# EasyEDA Pro project ProPrj_练手开发板_2024-08-21.epro, board T113_开发板
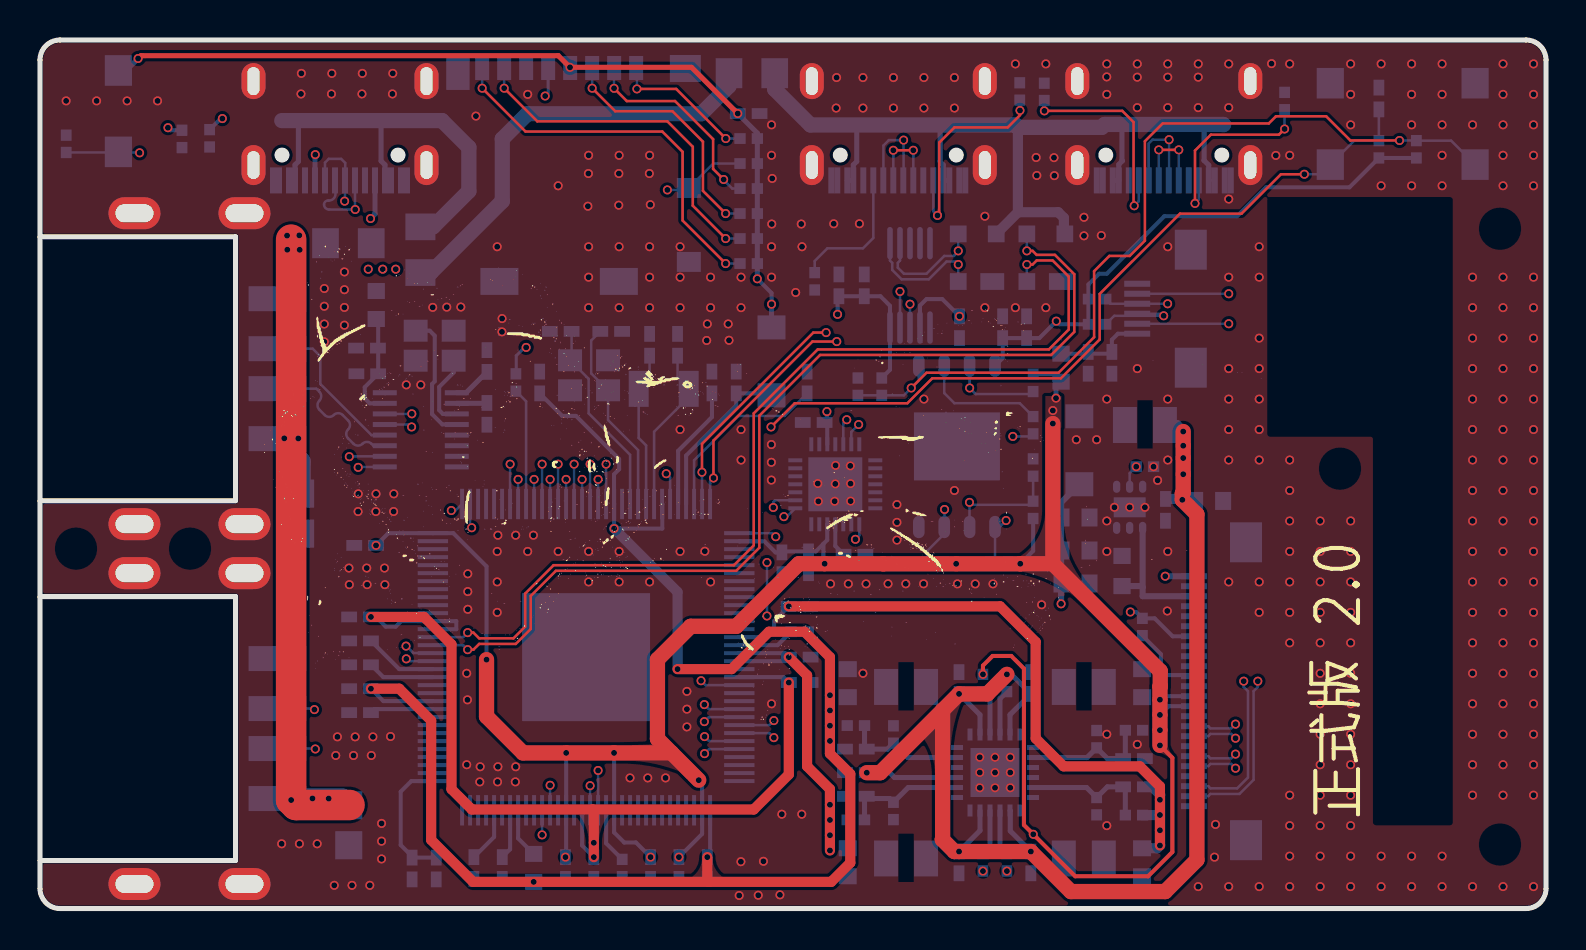
[diagram p5: board, top side]
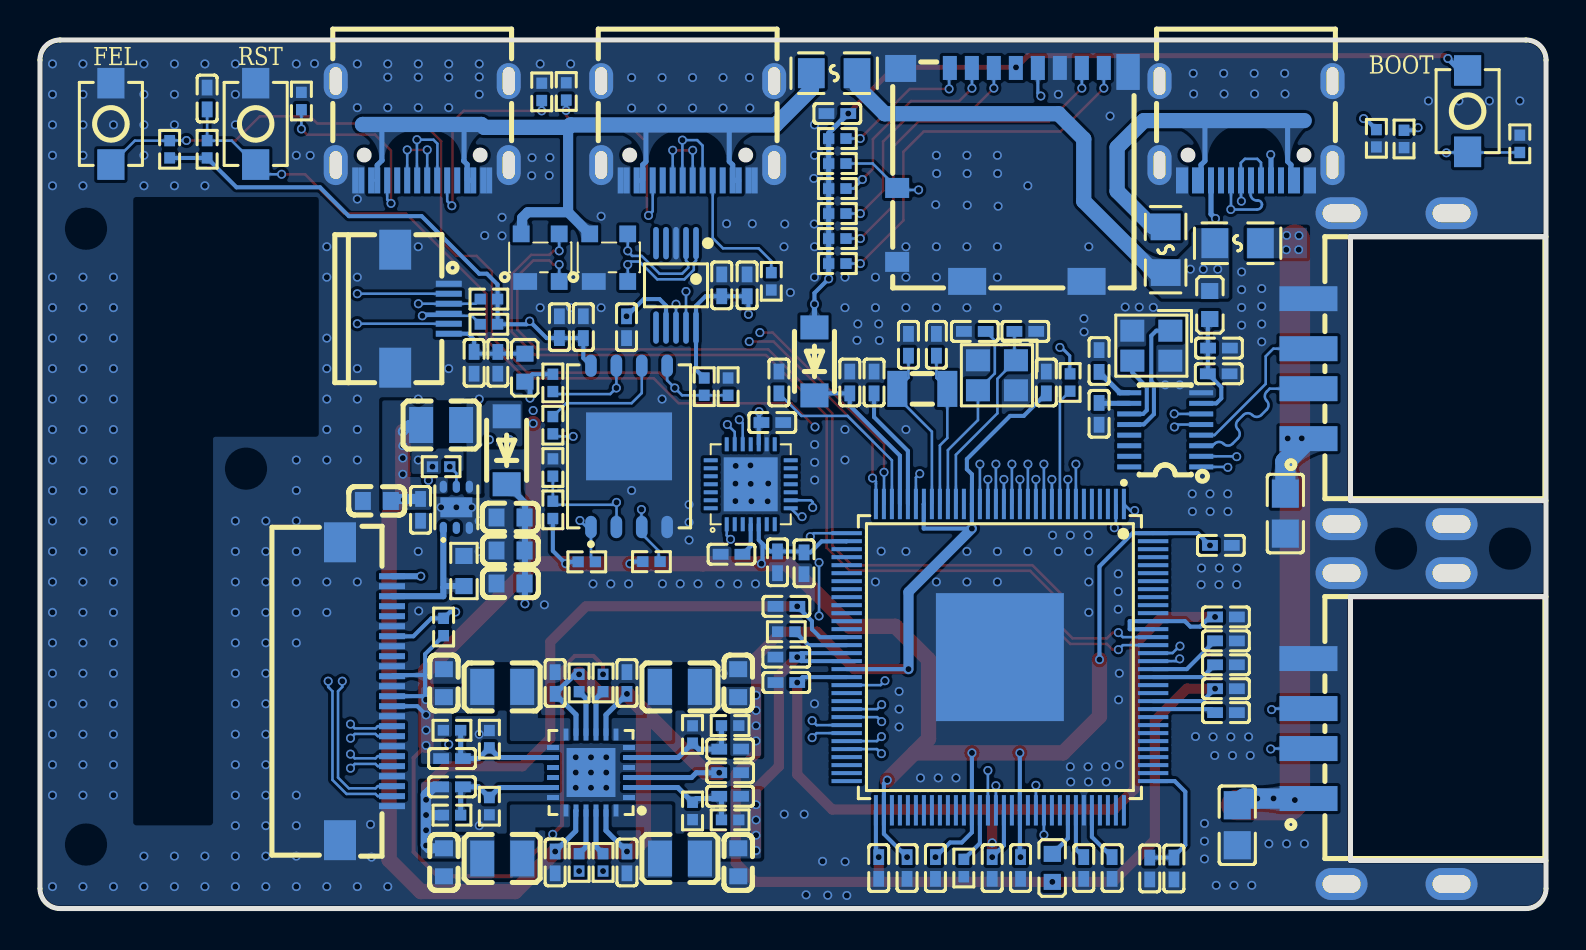
[diagram p6: board, bottom side, seen from below]

Outline 75.3 x 43.44 mm; copper layers: Top Layer, Inner1, Inner2, Bottom Layer. Coordinates in mm from the lower left corner of the outline.
Outline path: 0,42.44 0,1 arc(0.29,0.29) 1,0 74.3,0 arc(75.01,0.29) 75.3,1 75.3,42.44 arc(75.01,43.15) 74.3,43.44 1,43.44 arc(0.29,43.15) 0,42.44
Stack: Top Layer 0.035mm 外层铜厚1oz / Dielectric1 0.2104mm 7628 RC49% 8.6mil / Inner1 0.0152mm 内层铜厚 / Dielectric2 1.065mm 1.1mm H/HOZ 含铜 / Inner2 0.0152mm 内层铜厚 / Dielectric3 0.2104mm 7628 RC49% 8.6mil / Bottom Layer 0.035mm 外层铜厚1oz

## Design rules (mm)
net HUB_USB2_N: HUB_CH2
net HUB_USB2_P: HUB_CH2
net HUB_USB1_N: HUB_CH1
net HUB_USB1_P: HUB_CH1
net USB1_N: USB1
net USB1_P: USB1
net CH340_P: CH340
net CH340_N: CH340
net D0_N: MIPI_D0
net D0_P: MIPI_D0
net CLK_N: MIPI_CLK
net CLK_P: MIPI_CLK
net D1_N: MIPI_D1
net D1_P: MIPI_D1
net USB0_N: USB0
net USB0_P: USB0
net PC_N: DP1
net PC_P: DP1
template: 自定义配置
spacing copperThickness1oz (default): track to track 0.102, other pairs 0 to 0.3
track width copperThickness1oz (default): min 0.127, default 0.127, max 2.54
differential pair differentialPair (default): width min 0.127, default 0.127, max 2.54; gap min 0.152, default 0.152
via viaSize (default): diameter min 0.45, default 0.45, max 10; hole min 0.249, default 0.249, max 6.299
pour e18 uses power
pour e50 uses power
pour e150 uses power
pour e158 uses power
pour e335 uses power
pour e395 uses power
pour e423 uses power
pour e441 uses power
pour e468 uses power
pour e3233 uses power

## Placement (name value [footprint] x y rotation side)
C1  4.7uF  [C0402]  45.95 11.28 90 bottom
C2  22uF  [C0603]  55.11 11.27 270 bottom
C3  15pF  [C0402]  54.7 7.5 0 bottom
C4  4.7uF  [C0402]  49.54 2.31 270 bottom
C5  22uF  [C0603]  40.39 11.27 270 bottom
C6  15pF  [C0402]  40.79 7.97 180 bottom
C7  4.7uF  [C0402]  49.54 11.28 90 bottom
C8  4.7uF  [C0402]  40.79 6.79 180 bottom
C9  22uF  [C0603]  40.39 2.31 90 bottom
C10  15pF  [C0402]  40.79 5.61 180 bottom
C11  4.7uF  [C0402]  45.95 2.31 270 bottom
C12  22uF  [C0603]  55.1 2.31 90 bottom
C13  15pF  [C0402]  54.7 6.08 0 bottom
C14  1uF  [C0603]  51.77 16.26 180 bottom
C15  1uF  [C0603]  51.77 17.91 180 bottom
C16  1uF  [C0603]  51.77 19.56 180 bottom
C17  22uF  [C0603]  58.46 20.39 180 bottom
C18  100nF  [C0402]  56.27 19.94 270 bottom
C19  4.7uF  [C0402]  35.43 39.76 0 bottom
C20  100nF  [C0402]  49.33 29.08 90 bottom
C21  4.7uF  [C0402]  48.13 29.08 90 bottom
C31  4.7uF  [C0402]  16.36 26.75 180 bottom
C32  100nF  [C0402]  16.35 28.03 180 bottom
C33  4.7uF  [C0402]  22.35 27.38 90 bottom
C34  4.7uF  [C0402]  22.35 24.74 270 bottom
C37  4.7uF  [C0402]  41.21 31.17 270 bottom
C38  100nF  [C0402]  45.97 29.08 270 bottom
C39  4.7uF  [C0402]  39.94 31.17 270 bottom
C54  4.7uF  [C0402]  52.41 27.29 90 bottom
C55  100nF  [C0402]  53.59 27.29 90 bottom
C56  100nF  [C0402]  24.98 26.31 270 bottom
C57  4.7uF  [C0402]  16 13.39 0 bottom
C58  4.7uF  [C0402]  16 12.19 0 bottom
C59  4.7uF  [C0402]  33.6 26.31 90 bottom
C60  4.7uF  [C0402]  34.81 26.31 90 bottom
C61  NC  [C0402]  16 9.8 0 bottom
C62  15pF  [C0402]  26.03 28.86 180 bottom
C63  15pF  [C0402]  28.56 28.86 180 bottom
C64  4.7uF  [C0402]  18.61 2 90 bottom
C65  15pF  [C0402]  30.48 28.19 90 bottom
C66  100nF  [C0402]  38.35 26.31 270 bottom
C67  100nF  [C0402]  19.81 2 270 bottom
C68  100nF  [C0402]  37.1 17.27 90 bottom
C69  4.7uF  [C0402]  21.69 2.03 90 bottom
C70  15pF  [C0402]  31.88 28.19 90 bottom
C71  4.7uF  [C0402]  23.11 2.03 90 bottom
C72  100nF  [C0402]  37.98 15.11 180 bottom
C73  100nF  [C0402]  66.94 40.51 90 bottom
C74  100nF  [C0402]  30.53 2.03 270 bottom
C75  100nF  [C0402]  16.26 18.16 180 bottom
C76  100nF  [C0402]  26.27 2.03 270 bottom
C77  4.7uF  [C0402]  31.95 2.03 90 bottom
C78  100nF  [C0402]  37.99 11.3 0 bottom
C79  100nF  [C0402]  27.69 2.03 270 bottom
C80  4.7uF  [C0402]  16 14.58 0 bottom
C81  100nF  [C0402]  33.36 2.03 270 bottom
C82  4.7uF  [C0402]  16 10.99 0 bottom
C83  4.7uF  [C0402]  37.99 12.57 180 bottom
C84  100nF  [C0402]  40.72 17.72 180 bottom
C85  100nF  [C0402]  38.68 24.31 0 bottom
C86  100nF  [C0402]  38.43 17.32 90 bottom
C87  47uF  [C0805]  15.44 4.16 90 bottom
C88  47uF  [C0805]  13.03 19.75 90 bottom
D1  DSS210  [SOD-123_L2.8-W1.8-LS3.7-FD]  51.97 22.92 270 bottom
D2  PRTR5V0U2X  [SOT-143-4_L2.9-W1.3-P1.92-LS2.4-BL]  46.86 32.55 180 bottom
D3  PRTR5V0U2X  [SOT-143-4_L2.9-W1.3-P1.92-LS2.4-BL]  50.29 32.55 180 bottom
D4  DSS210  [SOD-123_L2.8-W1.8-LS3.7-FD]  36.58 27.36 270 bottom
F1  SL0805200  [F0805]  35.59 41.78 180 bottom
F2  SL0805200  [F0805]  19.02 32.95 270 bottom
F3  SL0805200  [F0805]  15.42 33.28 180 bottom
FPC1  AFC01-S24FCA-00  [FPC-SMD_P0.50-24P_FGS-XJ-H2.0]  59 10.87 90 bottom
FPC2  AFC01-S06FCA-00  [FPC-SMD_P0.50-6P_AFC01-S06FCA-00]  56.2 30 270 bottom
L1  1.5uH  [L0806]  52.19 11.08 180 bottom
L2  1.5uH  [L0806]  43.3 11.08 0 bottom
L3  1.5uH  [L0806]  43.3 2.5 0 bottom
L4  1.5uH  [L0806]  52.19 2.5 180 bottom
L6  GZ1608D601TF  [L0603]  16.81 30.18 270 bottom
L7  GZ1608D601TF  [L0603]  51.05 27.05 90 bottom
L8  GZ1608D601TF  [L0603]  24.68 2.03 90 bottom
R1  150kΩ  [R0402]  54.7 8.91 0 bottom
R2  33kΩ  [R0402]  52.83 8.47 270 bottom
R3  200kΩ  [R0402]  40.79 9.15 180 bottom
R4  100kΩ  [R0402]  42.67 8.7 90 bottom
R5  150kΩ  [R0402]  40.79 4.43 180 bottom
R6  100kΩ  [R0402]  48.34 11.28 270 bottom
R7  100kΩ  [R0402]  47.15 11.28 270 bottom
R8  100kΩ  [R0402]  47.15 2.31 90 bottom
R9  100kΩ  [R0402]  48.34 2.31 90 bottom
R10  100kΩ  [R0402]  42.67 4.88 270 bottom
R11  100kΩ  [R0402]  54.7 4.67 180 bottom
R12  200kΩ  [R0402]  52.83 5.12 270 bottom
R13  10kΩ  [R0402]  55.25 22.1 0 bottom
R14  10Ω  [R0603]  54.1 16.88 270 bottom
R15  10kΩ  [R0402]  35.43 38.51 0 bottom
R16  10kΩ  [R0402]  35.43 36.01 0 bottom
R17  10kΩ  [R0402]  35.43 34.76 0 bottom
R18  10kΩ  [R0402]  35.43 33.51 0 bottom
R19  10kΩ  [R0402]  35.43 32.26 0 bottom
R20  10kΩ  [R0402]  35.43 37.26 0 bottom
R21  10Ω  [R0402]  23.79 26.31 270 bottom
R22  10kΩ  [R0402]  47.96 17.34 0 bottom
R23  10kΩ  [R0402]  44.73 17.35 0 bottom
R24  10kΩ  [R0402]  49.66 26.29 90 bottom
R25  10kΩ  [R0402]  49.66 19.94 90 bottom
R26  NC  [R0402]  49.66 22.06 90 bottom
R27  10Ω  [R0402]  49.66 24.17 90 bottom
R28  NC  [R0402]  42.09 26.1 270 bottom
R29  10kΩ  [R0402]  40.89 26.1 90 bottom
R44  10kΩ  [R0402]  55.12 14.08 270 bottom
R45  10kΩ  [R0402]  52.86 29.22 180 bottom
R46  10kΩ  [R0402]  52.86 30.48 180 bottom
R47  240Ω  [R0402]  37.99 13.84 180 bottom
R48  240Ω  [R0402]  29.11 2.03 270 bottom
R49  10kΩ  [R0402]  66.94 37.97 270 bottom
R50  10kΩ  [R0402]  68.82 37.97 270 bottom
R55  5.1kΩ  [R0402]  62.23 40.39 270 bottom
R56  5.1kΩ  [R0402]  50.21 40.84 270 bottom
R57  5.1kΩ  [R0402]  48.99 40.87 270 bottom
R58  5.1kΩ  [R0402]  38.74 31.37 90 bottom
R59  5.1kΩ  [R0402]  7.1 38.49 90 bottom
R60  5.1kΩ  [R0402]  8.48 38.52 90 bottom
R61  10kΩ  [R0402]  1.31 38.25 270 bottom
SIM1  1040310811  [SIM-SMD_8P-1040310811]  26.67 36.7 0 bottom
SW1  TS342A2P-WZ  [SW-SMD_L4.0-W2.9-LS5.0]  64.52 39.24 90 bottom
SW2  TS342A2P-WZ  [SW-SMD_L4.0-W2.9-LS5.0]  71.75 39.24 90 bottom
SW3  TS342A2P-WZ  [SW-SMD_L4.0-W2.9-LS5.0]  3.92 39.88 90 bottom
U1  EA3059  [VQFN-24_L4.0-W4.0-P0.50-TL-EP2.5]  47.75 6.8 0 bottom
U2  10uH  [L0806]  55.25 24.18 180 bottom
U3  AW9962EDNR  [TDFN-6_L2.0-W2.0-P0.65-BL-EP]  54.48 20.07 180 bottom
U4  W25N01GVZEIG  [wson-8_l8.0-w6.10-p1.27-tl-ep]  45.85 23.11 90 bottom
U5  SL2.1s  [SSOP-16_L4.6-W2.6-P0.53-LS4.0-BL]  19.04 23.94 90 bottom
U6  CH340E  [MSOP-10_L3.0-W3.0-P0.50-LS5.0-BL]  43.5 31.17 0 bottom
U8  T113-S3  [tqfp-128_l14.0-w14.0-p0.40-ls16.0-bl-ep6.4]  27.31 12.57 0 bottom
U10  CH32V203G6U6  [QFN-28_L4.0-W4.0-P0.40-BL-EP2.7]  39.76 21.22 180 bottom
USB1  TYPEC-304A-ACP16W  [USB-C_SMD-TYPE-C-31-M-12]  42.92 38.9 0 bottom
USB2  TYPEC-304A-ACP16W  [USB-C_SMD-TYPE-C-31-M-12]  56.19 38.9 0 bottom
USB5  TYPEC-304A-ACP16W  [USB-C_SMD-TYPE-C-31-M-12]  15 38.9 0 bottom
USB6  U-A-24DS-W-1  [USB-A-SMD_U-A-24DS-W-1.]  8.3 9 90 bottom
USB7  U-A-24DS-W-1  [USB-A-SMD_U-A-24DS-W-1.]  8.3 27 90 bottom
X1  12MHz  [OSC-SMD_4P-L2.5-W2.0-BL]  19.73 28.15 0 bottom
X3  24MHz  [CRYSTAL-SMD_4P-L2.5-W2.0-BL]  27.45 26.67 0 bottom
X4  32.768kHz  [FC-135R_L3.2-W1.5]  31.18 25.99 0 bottom

## Footprints (pads in the part's own frame, mm; a bottom-side part is the same pattern mirrored in y, then rotated)
C0402
  rect 0.79x0.54 smd: 1(-0.545,0) 2(0.545,0)
C0603
  rect 0.8x0.9 smd: 1(-0.7,0) 2(0.7,0)
C0805
  rect 1.41x1.35 smd: 1(-1,0) 2(1,0)
CRYSTAL-SMD_4P-L2.5-W2.0-BL
  rect 1.2x1.1 smd: 1(-0.95,-0.75) 2(0.95,-0.75) 3(0.95,0.75) 4(-0.95,0.75)
F0805
  rect 1.335x1.5 smd: 1(-1.143,0) 2(1.143,0)
FC-135R_L3.2-W1.5
  rect 1x1.8 smd: 1(-1.25,0) 2(1.25,0)
FPC-SMD_P0.50-6P_AFC01-S06FCA-00
  rect 0.3x1.3 smd: 1(-1.248,1.339) 2(-0.748,1.339) 3(-0.248,1.339) 4(0.252,1.339) 5(0.752,1.339) 6(1.252,1.339)
  rect 2x1.6 smd: 7(-2.95,-1.339) 8(2.95,-1.339)
FPC-SMD_P0.50-24P_FGS-XJ-H2.0
  rect 0.3x1.3 smd: 1(-5.748,-1.3) 2(-5.248,-1.3) 3(-4.748,-1.3) 4(-4.248,-1.3) 5(-3.748,-1.3) 6(-3.248,-1.3) 7(-2.748,-1.3) 8(-2.248,-1.3) 9(-1.748,-1.3) 10(-1.248,-1.3) 11(-0.748,-1.3) 12(-0.248,-1.3) 13(0.252,-1.3) 14(0.752,-1.3) 15(1.252,-1.3) 16(1.752,-1.3) 17(2.252,-1.3) 18(2.752,-1.3) 19(3.252,-1.3) 20(3.752,-1.3) 21(4.252,-1.3) 22(4.752,-1.3) 23(5.252,-1.3) 24(5.752,-1.3)
  rect 2x1.6 smd: 25(7.45,1.3) 26(-7.45,1.3)
L0603
  rect 0.8x0.864 smd: 1(-0.7,0) 2(0.7,0)
L0806
  rect 1.2x1.8 smd: 1(-1,0) 2(1,0)
MSOP-10_L3.0-W3.0-P0.50-LS5.0-BL
  oval 0.28x1.62 smd: 1(-1,-2.11) 2(-0.5,-2.11) 3(0,-2.11) 4(0.5,-2.11) 5(1,-2.11) 6(1,2.11) 7(0.5,2.11) 8(0,2.11) 9(-0.5,2.11) 10(-1,2.11)
OSC-SMD_4P-L2.5-W2.0-BL
  rect 1.2x1.1 smd: 1(-0.95,-0.75) 2(0.95,-0.75) 3(0.95,0.75) 4(-0.95,0.75)
QFN-28_L4.0-W4.0-P0.40-BL-EP2.7
  rect 0.2x0.7 smd: 1(-1.2,-2) 2(-0.8,-2) 3(-0.4,-2) 4(-0.001,-2) 5(0.4,-2) 6(0.8,-2) 7(1.2,-2) 15(1.2,2) 16(0.8,2) 17(0.4,2) 18(0,2) 19(-0.4,2) 20(-0.8,2) 21(-1.2,2)
  rect 0.7x0.2 smd: 8(2,-1.2) 9(2,-0.8) 10(2,-0.4) 11(1.999,0) 12(2,0.4) 13(2,0.8) 14(2,1.2) 22(-2,1.2) 23(-2,0.8) 24(-2,0.4) 25(-2,0) 26(-2,-0.4) 27(-2,-0.8) 28(-2,-1.2)
  rect 2.7x2.7 smd: 29(0.001,0)
R0402
  rect 0.566x0.54 smd: 1(-0.433,0) 2(0.433,0)
R0603
  rect 0.806x0.864 smd: 1(-0.753,0) 2(0.753,0)
SIM-SMD_8P-1040310811
  rect 0.7x1.2 smd: 1(3.138,-5.338) 2(2.038,-5.338) 3(0.938,-5.338) 4(-0.163,-5.338) 5(-1.262,-5.338) 6(-2.362,-5.338) 7(-3.462,-5.338) 8(-4.562,-5.338)
  rect 1.17x1.8 smd: 9(-5.772,-5.138)
  rect 1.55x1.35 smd: 10(5.598,-5.312)
  rect 1.2x1 smd: 11(5.772,0.662) 12(5.772,4.362)
  rect 1.9x1.35 smd: 13(2.272,5.338) 14(-3.697,5.338)
SOD-123_L2.8-W1.8-LS3.7-FD
  rect 1.2x1.4 smd: 1(-1.7,0) 2(1.7,0)
SOT-143-4_L2.9-W1.3-P1.92-LS2.4-BL
  rect 1.194x0.838 smd: 1(-0.75,-1.192)
  rect 0.838x0.838 smd: 2(0.95,-1.192) 3(0.95,1.192) 4(-0.95,1.192)
SSOP-16_L4.6-W2.6-P0.53-LS4.0-BL
  rect 0.25x1.2 smd: 1(-1.855,-1.8) 2(-1.325,-1.8) 3(-0.795,-1.8) 4(-0.265,-1.8) 5(0.265,-1.8) 6(0.795,-1.8) 7(1.325,-1.8) 8(1.855,-1.8) 9(1.855,1.8) 10(1.325,1.8) 11(0.795,1.8) 12(0.265,1.8) 13(-0.265,1.8) 14(-0.795,1.8) 15(-1.325,1.8) 16(-1.855,1.8)
SW-SMD_L4.0-W2.9-LS5.0
  rect 1.53x1.36 smd: 1(-2.035,0) 2(2.035,0)
TDFN-6_L2.0-W2.0-P0.65-BL-EP
  oval 0.364x0.607 smd: 1(-0.65,-1.028) 2(0,-1.028) 3(0.65,-1.028) 4(0.65,1.028) 5(0,1.028) 6(-0.65,1.028)
  rect 1.6x1 smd: 7(0,0)
tqfp-128_l14.0-w14.0-p0.40-ls16.0-bl-ep6.4
  rect 0.2x1.52 smd: 1(-6.2,-7.66) 2(-5.8,-7.66) 3(-5.4,-7.66) 4(-5,-7.66) 5(-4.6,-7.66) 6(-4.2,-7.66) 7(-3.8,-7.66) 8(-3.4,-7.66) 9(-3,-7.66) 10(-2.6,-7.66) 11(-2.2,-7.66) 12(-1.8,-7.66) 13(-1.4,-7.66) 14(-1,-7.66) 15(-0.6,-7.66) 16(-0.2,-7.66) 17(0.2,-7.66) 18(0.6,-7.66) 19(1,-7.66) 20(1.4,-7.66) 21(1.8,-7.66) 22(2.2,-7.66) 23(2.6,-7.66) 24(3,-7.66) 25(3.4,-7.66) 26(3.8,-7.66) 27(4.2,-7.66) 28(4.6,-7.66) 29(5,-7.66) 30(5.4,-7.66) 31(5.8,-7.66) 32(6.2,-7.66) 65(6.2,7.66) 66(5.8,7.66) 67(5.4,7.66) 68(5,7.66) 69(4.6,7.66) 70(4.2,7.66) 71(3.8,7.66) 72(3.4,7.66) 73(3,7.66) 74(2.6,7.66) 75(2.2,7.66) 76(1.8,7.66) 77(1.4,7.66) 78(1,7.66) 79(0.6,7.66) 80(0.2,7.66) 81(-0.2,7.66) 82(-0.6,7.66) 83(-1,7.66) 84(-1.4,7.66) 85(-1.8,7.66) 86(-2.2,7.66) 87(-2.6,7.66) 88(-3,7.66) 89(-3.4,7.66) 90(-3.8,7.66) 91(-4.2,7.66) 92(-4.6,7.66) 93(-5,7.66) 94(-5.4,7.66) 95(-5.8,7.66) 96(-6.2,7.66)
  rect 1.52x0.2 smd: 33(7.66,-6.2) 34(7.66,-5.8) 35(7.66,-5.4) 36(7.66,-5) 37(7.66,-4.6) 38(7.66,-4.2) 39(7.66,-3.8) 40(7.66,-3.4) 41(7.66,-3) 42(7.66,-2.6) 43(7.66,-2.2) 44(7.66,-1.8) 45(7.66,-1.4) 46(7.66,-1) 47(7.66,-0.6) 48(7.66,-0.2) 49(7.66,0.2) 50(7.66,0.6) 51(7.66,1) 52(7.66,1.4) 53(7.66,1.8) 54(7.66,2.2) 55(7.66,2.6) 56(7.66,3) 57(7.66,3.4) 58(7.66,3.8) 59(7.66,4.2) 60(7.66,4.6) 61(7.66,5) 62(7.66,5.4) 63(7.66,5.8) 64(7.66,6.2) 97(-7.66,6.2) 98(-7.66,5.8) 99(-7.66,5.4) 100(-7.66,5) 101(-7.66,4.6) 102(-7.66,4.2) 103(-7.66,3.8) 104(-7.66,3.4) 105(-7.66,3) 106(-7.66,2.6) 107(-7.66,2.2) 108(-7.66,1.8) 109(-7.66,1.4) 110(-7.66,1) 111(-7.66,0.6) 112(-7.66,0.2) 113(-7.66,-0.2) 114(-7.66,-0.6) 115(-7.66,-1) 116(-7.66,-1.4) 117(-7.66,-1.8) 118(-7.66,-2.2) 119(-7.66,-2.6) 120(-7.66,-3) 121(-7.66,-3.4) 122(-7.66,-3.8) 123(-7.66,-4.2) 124(-7.66,-4.6) 125(-7.66,-5) 126(-7.66,-5.4) 127(-7.66,-5.8) 128(-7.66,-6.2)
  rect 6.4x6.4 smd: 129(0,0)
USB-A-SMD_U-A-24DS-W-1.
  rect 1.25x2.9 smd: 1(-3.5,3.577) 2(-1,3.577) 3(1,3.577) 4(3.5,3.577)
  oval 1.6x2.6 hole 0.9x1.9: 5(-7.775,-3.577) 5(-7.775,1.923) 5(7.775,-3.577) 5(7.775,1.923)
USB-C_SMD-TYPE-C-31-M-12
  oval 1.2x1.8 hole 0.6x1.4: 0(-4.325,-2.484) 0(4.325,-2.484)
  oval 1.2x2 hole 0.6x1.4: 0(-4.325,1.716) 0(4.325,1.716)
  rect 0.3x1.3 smd: A1(-3.35,2.484) A4(-2.55,2.484) A5(-1.25,2.484) A6(-0.25,2.484) A7(0.25,2.484) A8(1.25,2.484) A9(2.55,2.484) A12(3.35,2.484) B1(3.05,2.484) B4(2.25,2.484) B5(1.75,2.484) B6(0.75,2.484) B7(-0.75,2.484) B8(-1.75,2.484) B9(-2.25,2.484) B12(-3.05,2.484)
VQFN-24_L4.0-W4.0-P0.50-TL-EP2.5
  rect 0.6x0.25 smd: 1(-1.9,1.25) 2(-1.9,0.75) 3(-1.9,0.25) 4(-1.9,-0.25) 5(-1.9,-0.75) 6(-1.9,-1.25) 13(1.9,-1.25) 14(1.9,-0.75) 15(1.9,-0.25) 16(1.9,0.25) 17(1.9,0.75) 18(1.9,1.25)
  rect 0.25x0.6 smd: 7(-1.25,-1.9) 8(-0.75,-1.9) 9(-0.25,-1.9) 10(0.249,-1.9) 11(0.75,-1.9) 12(1.25,-1.9) 19(1.25,1.9) 20(0.75,1.9) 21(0.249,1.9) 22(-0.25,1.9) 23(-0.75,1.9) 24(-1.25,1.9)
  rect 2.45x2.45 smd: 25(0,0)
wson-8_l8.0-w6.10-p1.27-tl-ep
  oval 1.115x0.581 smd: 1(-4.033,1.905) 2(-4.033,0.635) 3(-4.033,-0.635) 4(-4.033,-1.905) 5(4.033,-1.905) 6(4.033,-0.635) 7(4.033,0.635) 8(4.033,1.905)
  rect 3.4x4.3 smd: 9(0,0)

## Nets
As in the schematic.

Pads without a net: FPC1 16 20 21; U1 15 16; U3 2; U5 13 14 15 16; U6 4 5 6; U8 3 4 5 6 21 35 36 37 38 39 40 41 42 43 44 45 53 54 61 62 63 64 67 68 69 70 71 72 73 74 75 76 82 84 87 88 93 94 95 96 98 99 100 101 102 103 104 105 108 109 118 119 120 121 122 123 124 125 126 127; U10 2 3 6 7 10 11 12 13 14 15 18 21 22 23 24 25 26 27 28; USB1 A8 B8; USB2 A8 B8; USB5 A8 B8

## Via types
v1: diameter 0.45, hole 0.3, Top Layer to Bottom Layer, 570 vias

## Routing (per net, layer and track width the routed paths; a pad name or vN(x,y) marks a point on that pad's centre or on a via; arc(x,y) is an arc through that point)
0.9V: length 116.3
  Top Layer w0.508: 27.63,4.95 35.69,4.95 37.44,6.71 v1(37.44,11.3) ; 27.63,4.95 21.59,4.95 20.57,5.97 20.57,13.21 19.2,14.58 v1(16.55,14.58) ; 27.63,4.95 27.69,4.89 v1(27.69,3.29) v1(27.69,2.57) ; v1(37.44,15.11) 48.01,15.11 49.78,13.33 49.78,8.51 51.18,7.11 54.99,7.11 56,6.11 v1(56,5.44) v1(56,4.68) v1(56,3.91) v1(56,3.15)
  Inner2 w0.762: v1(56,3.15) 56,2.34 54.67,1.02 39.37,1.02 36.81,3.58 27.89,3.58 27.69,3.38 v1(27.69,2.57)
  Bottom Layer w0.203: U8.46 36.31,13.57 36.7,13.97 36.7,14.38 v1(37.44,15.11) ; U8.116 19.65,13.97 20.81,13.97 20.81,14.37 U8.117 18.06,14.37 17.78,14.1 17.29,14.1 16.8,14.58 ; v1(27.69,2.57) 27.1,3.16 27.1,4.91 ; v1(37.44,11.3) 37.17,11.57 U8.51
  Bottom Layer w0.508: C12.2 55.86,3.01 v1(56,3.15) 56.01,3.17 56.01,5.69 55.62,6.08 C13.2 ; R11.1 55.99,4.67 v1(56,4.68)
1.5V: length 15.6
  Top Layer w0.508: v1(39.5,2.9) v1(39.5,3.67) v1(39.5,4.43) v1(39.5,5.19) 39.5,5.97 38.35,7.11 38.35,11.66 v1(37.44,12.57)
  Bottom Layer w0.203: U8.48 37.24,12.77 v1(37.44,12.57) 37.24,12.37 U8.49
1.8V: length 82.5
  Top Layer w0.508: 33.45,1.33 v1(24.68,1.33) 21.66,1.33 19.56,3.43 19.56,9.4 17.96,10.99 v1(16.55,10.99) ; 33.45,1.33 33.36,1.42 v1(33.36,2.57) ; 33.45,1.33 39.56,1.33 40.51,2.29 40.51,6.73 39.5,7.75 v1(39.5,8.38) v1(39.5,9.14) v1(39.5,9.91) v1(39.5,10.67) 39.5,12.57 38.23,13.84 36.45,13.84 34.58,11.97 v1(31.88,11.97)
  Bottom Layer w0.203: U8.107 17.17,10.37 v1(16.55,10.99) ; U8.50 v1(31.88,11.97) ; U8.65 33.5,2.71 v1(33.36,2.57) ; C56.2 26.11,24.64 26.8,24.64 28.96,22.48 28.96,21.97 28.7,21.72 28.7,20.24 U8.20 v1(28.71,19) 31.12,19 31.12,20.22 31.1,20.23
  Bottom Layer w0.508: v1(31.88,11.97) 31.88,15.83 v1(28.71,19)
3.3V: length 248.8
  Top Layer w0.203: v1(56,8.16) 56.62,7.54 56.62,2.83 55.41,1.61 51.76,1.61 v1(49.66,3.71) 49.2,4.18 49.2,12 48.56,12.63 47.63,12.63 47.15,12.15 v1(47.15,11.71)
  Top Layer w0.254: v1(34.89,39.76) 32.58,42.07 v1(26.5,42.07) 25.92,42.65 5.05,42.65 v1(4.91,42.52)
  Top Layer w0.762: 31.57,7.78 30.87,8.48 30.87,12.45 32.53,14.11 34.81,14.11 37.94,17.25 v1(39.23,17.25) 42.16,17.25 42.16,17.24 v1(45.81,17.24) 49.01,17.24 v1(49.01,17.25) 50.64,17.25 ; 31.57,7.78 v1(32.94,6.42) ; 31.57,7.78 v1(28.7,7.78) v1(26.31,7.78) 24.15,7.78 22.33,9.61 v1(22.33,12.45) ; v1(56,8.16) v1(56,8.92) v1(56,9.68) v1(56,10.44) 56,11.1 56.01,11.11 56.01,11.88 50.64,17.25 ; 50.64,17.25 v1(50.64,24.26)
  Inner1 w0.762: v1(50.82,29.38) 50.8,29.36 50.8,27.45 ; v1(50.64,24.26) v1(50.64,24.91) 50.64,25.37 v1(50.8,25.53) 50.8,27.45 ; v1(36.58,30.23) 37.08,29.72 v1(39.88,29.72) 39.88,29.71 40.24,29.35 40.64,29.35 ; 40.64,29.35 45.7,29.35 v1(45.97,29.62) 45.97,28.13 46.66,27.45 50.8,27.45 ; 40.64,29.35 40.64,27.89 39.34,26.59 v1(39.34,24.85) 39.34,24.36
  Inner2 w0.203: v1(49.66,3.71) 48.34,2.39 v1(48.34,1.87) v1(47.15,1.87)
  Bottom Layer w0.203: v1(45.97,29.62) 45.11,30.48 44.32,30.48 44,30.16 U6.7 ; v1(31.95,2.57) 33.1,3.73 33.1,6.25 v1(32.94,6.42) ; v1(26.27,2.57) 26.31,2.6 U8.83 26.31,4.92 v1(26.31,7.78) ; FPC1.11 56.43,10.12 v1(56,9.68) ; FPC1.12 56.17,10.62 56.04,10.49 ; U8.34 34.98,18.36 36.22,18.36 36.78,17.81 C68.2 37.15,17.86 C86.2 38.79,17.86 39.17,18.24 ; 39.26,24.32 39.34,24.4 v1(39.34,24.85) ; R24.2 50.68,26.72 L7.1 ; R50.2 R49.2 65.47,36.07 61.3,36.07 59.86,34.63 56.22,34.63 53.34,31.75 52.96,31.75 52.42,31.21 R46.2 R45.2 50.97,29.22 v1(50.82,29.38) 49.97,28.53 C20.1 C21.1 48.13,27.53 U4.8 ; 39.17,18.24 39.17,17.3 v1(39.23,17.25) ; 39.17,18.24 39.36,18.43 39.36,19.22 ; C85.2 39.36,24.17 U10.17 ; v1(22.33,12.45) 22.33,17.11 20.67,18.77 U8.128 17.41,18.77 v1(16.8,18.16) ; R25.1 49.66,17.89 v1(49.01,17.25) 48.92,17.34 R22.2 ; 56.04,10.49 56.04,11.67 ; 56.04,10.49 v1(56,10.44) ; R28.1 42.5,26.95 U6.10 42.5,30.14 42.02,30.62 C37.2 C39.2 39.88,30.56 v1(39.88,29.72) ; 56.04,11.67 57.65,11.67 FPC1.14 ; 56.04,11.67 56.04,12.72 55.12,13.65 ; v1(30.53,2.57) 29.8,3.3 29.21,3.3 28.71,3.81 U8.77 28.71,7.78 v1(28.7,7.78) ; v1(35.87,31.5) 36.58,30.78 v1(36.58,30.23) ; v1(45.81,17.24) 45.7,17.35 R23.2
  Bottom Layer w0.254: v1(4.91,42.52) 4.31,41.92 SW3.2 ; L7.1 50.8,26.1 v1(50.8,25.53) ; v1(34.89,39.76) 35.87,38.78 R15.2 R20.2 R16.2 R17.2 R18.2 R19.2 v1(35.87,31.5) ; D4.1 v1(36.58,30.23)
5V: length 146.8
  Top Layer w0.762: 45.13,9.91 v1(45.95,10.73) 47.37,10.73 v1(48.34,11.71) ; 45.13,9.91 45.13,3.47 45.12,3.45 45.72,2.85 v1(45.95,2.85) v1(49.54,2.85) 51.54,0.85 56.26,0.85 57.84,2.43 57.84,19.71 v1(57.12,20.44) 57.12,20.76 57.16,20.8 v1(57.16,21.72) v1(57.16,22.53) v1(57.16,23.15) v1(57.16,23.86) ; 45.13,9.91 42.01,6.79 v1(41.34,6.79)
  Inner1 w0.762: v1(16.41,31.98) v1(17.14,31.98) v1(17.79,31.98) 19.18,31.98 21.28,34.08 31.04,34.08 32.45,35.49 52.69,35.49 57.12,31.06 v1(57.12,20.44)
  Bottom Layer w0.254: U1.23 47,3.9 v1(45.95,2.85) ; U1.8 47,9.69 v1(45.95,10.73) ; v1(49.54,2.85) 48.51,3.88 48.51,4.89 U1.20 ; v1(48.34,11.71) 48.56,11.71 C7.1 48.5,9.69 U1.11 ; U1.3 42.72,6.55 42.48,6.79 v1(41.34,6.79)
  Bottom Layer w0.508: C18.1 57.66,20.48 C17.2 ; v1(57.16,23.86) 56.84,24.18 U2.1
  Bottom Layer w0.762: F2.2 19.54,31.81 23.11,35.38 23.11,38.49 24.37,39.75 33.06,39.75 34.45,41.14 F1.2
GND:
  vias: v1(1.31,40.39) v1(2.83,40.39) v1(4.35,40.39) v1(5.88,40.39) v1(12.08,3.24) v1(13.05,40.74) v1(12.97,3.24) v1(13.07,41.77) v1(13.86,3.24) v1(14.21,31.01) v1(14.21,30.12) v1(14.21,29.23) v1(14.21,28.34) v1(14.59,41.77) v1(14.57,40.74) v1(14.71,1.16) v1(14.79,7.65) v1(14.87,8.59) v1(15.22,31.84) v1(15.22,30.95) v1(15.22,30.06) v1(15.22,29.17) v1(15.45,17.03) v1(15.47,16.2) v1(15.6,1.16) v1(15.68,7.65) v1(15.76,8.59) v1(15.91,20.74) v1(15.9,19.85) v1(16.12,41.77) v1(16.1,40.74) v1(16.34,17.03) v1(16.35,16.2) v1(16.49,1.16) v1(16.65,8.59) v1(16.56,7.65) v1(16.8,20.74) v1(16.79,19.85) v1(17.08,4.26) v1(17.08,3.37) v1(17.08,2.48) v1(17.22,17.03) v1(17.24,16.2) v1(17.53,8.6) v1(17.64,41.77) v1(17.62,40.74) v1(17.69,20.74) v1(17.68,19.85) v1(18.31,26.19) v1(19.04,26.19) v1(19.64,30.07) v1(20.34,30.08) v1(21.04,30.08) v1(21.34,11.76) v1(21.34,7.19) v1(21.39,16.74) v1(21.39,15.85) v1(21.39,14.96) v1(21.37,10.44) v1(21.8,39.63) v1(22.01,7.09) v1(21.99,6.33) v1(22.86,33.1) v1(22.9,18.67) v1(22.86,17.86) v1(22.86,16.34) v1(22.86,14.81) v1(22.9,7.09) v1(22.88,6.33) v1(23.1,29.51) v1(23.1,28.84) v1(23.78,18.67) v1(23.78,7.09) v1(23.77,6.33) v1(24.38,40.72) v1(24.38,17.86) v1(24.67,18.67) v1(25.91,36.15) v1(25.91,17.86) v1(27.43,37.67) v1(27.42,36.76) v1(27.4,35.13) v1(27.43,33.1) v1(27.43,31.58) v1(27.43,30.05) v1(27.43,17.86) v1(27.43,16.34) v1(28.94,36.76) v1(28.94,35.18) v1(28.96,37.67) v1(28.96,33.1) v1(28.96,30.05) v1(28.96,17.86) v1(28.96,16.34) v1(29.5,6.53) v1(30.39,6.53) v1(30.48,37.67) v1(30.47,36.76) v1(30.51,35.2) v1(30.48,33.1) v1(30.48,31.58) v1(30.48,30.05) v1(30.48,16.34) v1(31.28,6.53) v1(32,33.1) v1(32,31.58) v1(32,30.05) v1(32,23.96) v1(32,17.86) v1(32.34,10.86) v1(32.34,9.97) v1(32.34,9.08) v1(33.24,17.87) v1(33.33,28.41) v1(33.37,29.24) v1(33.53,31.58) v1(33.53,30.05) v1(33.53,16.34) v1(34.41,29.24) v1(34.45,28.42) v1(35.04,2.34) v1(34.96,0.65) v1(35.05,31.58) v1(35.05,30.05) v1(35.05,23.96) v1(35.05,22.43) v1(35.91,0.66) v1(36.17,2.36) v1(36.58,39.2) v1(36.58,37.67) v1(36.61,36.52) v1(36.59,34.24) v1(36.58,33.1) v1(36.58,31.58) v1(36.57,23.21) v1(36.57,22.32) v1(36.57,21.43) v1(36.58,10.24) v1(37,0.68) v1(37.09,4.72) v1(37.78,30.81) v1(38.06,34.24) v1(38.1,33.1) v1(38.09,4.72) v1(38.89,21.26) v1(38.92,20.37) v1(39.53,16.24) v1(39.69,34.25) v1(39.73,20.37) v1(39.83,41.56) v1(39.81,40.04) v1(39.78,22.16) v1(39.76,21.24) v1(40.41,16.24) v1(40.51,22.14) v1(40.53,21.25) v1(40.53,20.38) v1(40.97,34.25) v1(41.15,41.56) v1(41.15,40.04) v1(41.15,11.76) v1(41.3,16.24) v1(42.4,16.24) v1(42.67,41.56) v1(42.67,40.04) v1(42.85,20.2) v1(42.85,19.31) v1(42.85,18.43) v1(43.29,16.24) v1(44.2,41.56) v1(44.2,40.04) v1(44.2,25.48) v1(44.18,16.24) v1(45.72,41.56) v1(45.72,40.04) v1(45.72,20.91) v1(45.87,16.24) v1(46.76,16.24) v1(46.99,7.56) v1(46.99,6.8) v1(46.99,6.04) v1(47.24,34.62) v1(47.24,30.05) v1(47.65,16.24) v1(47.75,7.56) v1(47.75,6.8) v1(47.75,6.04) v1(48.51,7.56) v1(48.51,6.8) v1(48.51,6.04) v1(48.77,42.24) v1(48.77,30.05) v1(49.81,37.56) v1(49.84,36.66) v1(50.08,15.19) v1(50.29,42.24) v1(50.29,30.05) v1(50.7,37.56) v1(50.72,36.65) v1(51.82,23.45) v1(52.2,34.57) v1(52.2,33.65) v1(52.83,23.45) v1(53.07,33.66) v1(53.34,42.24) v1(53.34,41.59) v1(53.34,40.72) v1(53.34,25.48) v1(53.34,19.38) v1(53.34,17.86) v1(53.34,8.72) v1(53.34,4.14) v1(53.72,20.07) v1(54.48,20.07) v1(54.86,42.24) v1(54.86,41.58) v1(54.86,40.06) v1(54.86,27) v1(54.86,8.21) v1(55.25,20.07) v1(55.68,22.1) v1(55.88,21.42) v1(56.39,42.24) v1(56.39,41.58) v1(56.39,40.06) v1(56.39,33.1) v1(56.39,25.48) v1(56.39,22.43) v1(56.39,17.86) v1(56.36,14.88) v1(57.91,42.24) v1(57.91,41.58) v1(57.91,40.06) v1(57.91,1.1) v1(58.72,2.57) v1(58.78,4.21) v1(59.44,42.24) v1(59.44,40.06) v1(59.44,35.48) v1(59.44,31.58) v1(59.44,27) v1(59.44,25.48) v1(59.44,23.96) v1(59.44,22.43) v1(59.44,16.34) v1(59.44,1.1) v1(60.96,33.1) v1(60.96,31.58) v1(60.96,28.53) v1(60.96,27) v1(60.96,25.48) v1(60.96,23.96) v1(60.96,22.43) v1(60.96,16.34) v1(60.96,14.81) v1(60.96,1.1) v1(61.58,42.26) v1(61.79,37.67) v1(62.48,42.24) v1(62.48,37.67) v1(62.48,22.43) v1(62.48,20.91) v1(62.48,19.38) v1(62.48,17.86) v1(62.48,16.34) v1(62.48,14.81) v1(62.48,13.29) v1(62.48,5.67) v1(62.48,4.14) v1(62.48,2.62) v1(62.48,1.1) v1(64.01,19.38) v1(64.01,17.86) v1(64.01,16.34) v1(64.01,14.81) v1(64.01,13.29) v1(64.01,11.76) v1(64.01,10.24) v1(64.01,8.72) v1(64.01,7.19) v1(64.01,5.67) v1(64.01,4.14) v1(64.01,2.62) v1(64.01,1.1) v1(65.53,42.24) v1(65.53,40.72) v1(65.53,39.2) v1(65.53,19.38) v1(65.53,17.86) v1(65.53,16.34) v1(65.53,14.81) v1(65.53,13.29) v1(65.53,11.76) v1(65.53,10.24) v1(65.53,8.72) v1(65.53,7.19) v1(65.53,5.67) v1(65.53,4.14) v1(65.53,2.62) v1(65.53,1.1) v1(67.06,42.24) v1(67.06,36.15) v1(67.06,2.62) v1(67.06,1.1) v1(68.58,42.24) v1(68.58,40.72) v1(68.58,39.2) v1(68.58,36.15) v1(68.58,2.62) v1(68.58,1.1) v1(70.1,42.24) v1(70.1,40.72) v1(70.1,39.2) v1(70.1,37.67) v1(70.1,36.15) v1(70.1,2.62) v1(70.1,1.1) v1(71.63,39.2) v1(71.63,31.58) v1(71.63,30.05) v1(71.63,28.53) v1(71.63,27) v1(71.63,25.48) v1(71.63,23.96) v1(71.63,22.43) v1(71.63,20.91) v1(71.63,19.38) v1(71.63,17.86) v1(71.63,16.34) v1(71.63,14.81) v1(71.63,13.29) v1(71.63,11.76) v1(71.63,10.24) v1(71.63,8.72) v1(71.63,7.19) v1(71.63,5.67) v1(71.63,1.1) v1(73.15,42.24) v1(73.15,40.72) v1(73.15,39.2) v1(73.15,37.67) v1(73.15,36.15) v1(73.15,31.58) v1(73.15,30.05) v1(73.15,28.53) v1(73.15,27) v1(73.15,25.48) v1(73.15,23.96) v1(73.15,22.43) v1(73.15,20.91) v1(73.15,19.38) v1(73.15,17.86) v1(73.15,16.34) v1(73.15,14.81) v1(73.15,13.29) v1(73.15,11.76) v1(73.15,10.24) v1(73.15,8.72) v1(73.15,7.19) v1(73.15,5.67) v1(73.15,1.1) v1(74.68,42.24) v1(74.68,40.72) v1(74.68,39.2) v1(74.68,37.67) v1(74.68,36.15) v1(74.68,31.58) v1(74.68,30.05) v1(74.68,28.53) v1(74.68,27) v1(74.68,25.48) v1(74.68,23.96) v1(74.68,22.43) v1(74.68,20.91) v1(74.68,19.38) v1(74.68,17.86) v1(74.68,16.34) v1(74.68,14.81) v1(74.68,13.29) v1(74.68,11.76) v1(74.68,10.24) v1(74.68,8.72) v1(74.68,7.19) v1(74.68,5.67) v1(74.68,1.1)
CH32_BOOT: length 60.9
  Inner2 w0.127: v1(40.77,18.47) 40.22,19.02 36.4,19.02 35.93,19.49 22.77,19.49 21.92,18.65 21.16,18.65 20.13,19.67 20.13,20.87 22.08,22.82 22.08,31.51 19.47,34.11 14.61,34.11 12.89,35.84 12.89,38.25 12.49,38.65 5.83,38.65 v1(4.98,37.8)
  Bottom Layer w0.127: 3.89,37.81 SW3.1 ; 3.89,37.81 4.96,37.81 v1(4.98,37.8) ; 3.89,37.81 R61.2 ; U10.1 40.96,18.66 v1(40.77,18.47)
CH340_N: length 19.2
  Inner2 w0.127: v1(45.91,32.89) 45.62,32.89 45.42,32.69 43.63,32.69 42.94,33.38 42.94,37.42 43.18,37.65 v1(43.18,38.43)
  Bottom Layer w0.127: 43.17,36.4 43.18,36.41 v1(43.18,38.43) 42.44,38.43 42.17,38.16 42.17,36.4 42.17,36.4 ; D2.3 v1(45.91,32.89) 45.91,32.86 45.7,32.64 45.21,32.64 44.32,31.75 43.19,31.75 42.89,32.06 42.89,32.29 43,32.4 U6.2
CH340_P: length 19.2
  Top Layer w0.127: v1(43.67,37.92) v1(42.67,37.92)
  Inner2 w0.127: v1(42.67,37.92) 42.67,35.12 arc(42.59,34.94) 42.4,34.86 arc(42.22,34.78) 42.14,34.6 42.14,34.11 arc(42.22,33.92) 42.4,33.85 arc(42.59,33.77) 42.67,33.58 42.67,33.26 43.53,32.39 45.42,32.39 45.6,32.21 v1(45.91,32.21)
  Bottom Layer w0.127: U6.1 42.5,32.4 42.61,32.29 42.61,31.94 43.08,31.47 44.44,31.47 45.33,32.36 45.76,32.36 v1(45.91,32.21) D2.2 ; 43.67,36.4 v1(43.67,37.92) ; 42.67,36.4 v1(42.67,37.92)
CLK_N: length 37.4
  Inner2 w0.127: v1(33.23,7.75) 33.52,7.75 33.8,8.03 34.77,8.03 35.33,7.47 44.06,7.47 45.03,8.44 52.39,8.44 53.49,9.54 53.49,11.06 54.24,11.81 56.13,11.81 56.51,11.43 56.51,8.37 57.65,7.23 59.27,7.23 59.49,7.02 v1(59.78,7.02)
  Bottom Layer w0.127: v1(33.23,7.75) 33.45,7.97 U8.60 ; v1(59.78,7.02) 59.56,7.23 58.52,7.23 58.41,7.12 FPC1.5
CLK_P: length 37.4
  Inner2 w0.127: v1(59.78,7.72) 59.49,7.72 59.27,7.51 57.77,7.51 56.79,8.48 56.79,11.55 56.25,12.09 54.13,12.09 53.21,11.18 53.21,9.65 52.28,8.72 44.91,8.72 43.94,7.75 35.45,7.75 34.88,8.31 33.8,8.31 33.52,8.6 v1(33.23,8.6)
  Bottom Layer w0.127: v1(33.23,8.6) 33.45,8.37 U8.59 ; v1(59.78,7.72) 59.56,7.51 58.52,7.51 58.41,7.62 FPC1.6
CTP_INT: length 70.2
  Inner2 w0.127: v1(59.44,29.25) 59.44,28.7 58.89,28.15 58.89,15.83 62.48,12.23 62.48,7.2 60.62,5.33 57.02,5.33 56.13,6.22 52.75,6.22 50.97,4.44 41.28,4.44 40,5.72 36.62,5.72 35.35,4.44 25.87,4.44 v1(25.1,3.68)
  Bottom Layer w0.127: 25.1,4.91 v1(25.1,3.68) ; v1(59.44,29.25) FPC2.5
CTP_RST: length 71.6
  Inner2 w0.127: v1(25.5,6.16) 25.5,5.36 26.08,4.78 35.21,4.78 36.48,6.05 40.15,6.05 41.42,4.78 50.83,4.78 52.6,6.56 56.27,6.56 57.16,5.67 60.48,5.67 62.15,7.34 62.15,12.09 58.55,15.69 58.55,28.45 58.93,28.83 58.93,30.24 v1(59.44,30.75)
  Bottom Layer w0.127: 25.5,4.93 v1(25.5,6.16) ; v1(59.44,30.75) FPC2.2
D0_N: length 45.2
  Inner2 w0.127: v1(60.89,11.37) 60.89,11.08 60.68,10.87 60.68,10.25 60.31,9.88 59.07,9.88 58.52,10.43 58.52,12.84 57.26,14.1 37.36,14.1 35.59,12.32 35.59,10.43 34.79,9.63 33.79,9.63 33.51,9.35 v1(33.22,9.35)
  Bottom Layer w0.127: 34.96,9.57 33.44,9.57 v1(33.22,9.35) ; v1(60.89,11.37) 60.89,11.08 60.68,10.87 60.68,6.44 59.97,5.73 58.52,5.73 58.41,5.62 FPC1.2
D0_P: length 45.1
  Inner2 w0.127: v1(33.22,10.2) 33.51,10.2 33.79,9.91 34.67,9.91 35.31,10.55 35.31,10.95 arc(35.23,11.13) 35.05,11.21 34.93,11.21 arc(34.67,11.46) 34.93,11.71 35.05,11.71 arc(35.23,11.79) 35.31,11.97 35.31,12.43 37.25,14.38 57.38,14.38 58.8,12.95 58.8,10.54 59.18,10.16 60.2,10.16 60.4,10.36 60.4,10.87 60.19,11.08 v1(60.19,11.37)
  Bottom Layer w0.127: FPC1.3 58.41,6.12 58.52,6.01 59.86,6.01 60.4,6.55 60.4,10.87 60.19,11.08 v1(60.19,11.37) ; 34.96,9.97 33.44,9.97 v1(33.22,10.2)
D1_N: length 33.9
  Inner2 w0.127: v1(36.69,8.55) 36.98,8.55 37.27,8.83 38.06,8.83 38.63,9.41 38.63,12.34 39.37,13.08 56.37,13.08 57.51,11.95 57.51,9.8 58.58,8.73 59.27,8.73 59.49,8.52 v1(59.78,8.52)
  Bottom Layer w0.127: v1(59.78,8.52) 59.56,8.73 58.52,8.73 58.41,8.62 FPC1.8 ; v1(36.69,8.55) 36.47,8.77 34.96,8.77
D1_P: length 33.9
  Inner2 w0.127: v1(36.69,9.4) 36.98,9.4 37.27,9.11 37.94,9.11 38.35,9.53 38.35,12.46 39.25,13.36 56.49,13.36 57.78,12.06 57.78,9.92 58.7,9.01 59.27,9.01 59.49,9.22 v1(59.78,9.22)
  Bottom Layer w0.127: FPC1.9 58.41,9.12 58.52,9.01 59.56,9.01 v1(59.78,9.22) ; 34.96,9.17 36.47,9.17 v1(36.69,9.4)
HUB_USB1_N: length 8
  Bottom Layer w0.127: USB7.2 13.82,26 13.97,25.85 arc(14.06,25.62) 13.97,25.4 arc(13.88,25.18) 13.97,24.95 14.24,24.68 arc(14.46,24.59) 14.69,24.68 arc(14.91,24.77) 15.14,24.68 15.41,24.41 arc(15.5,24.19) 15.41,23.96 arc(15.31,23.74) 15.41,23.51 15.67,23.24 arc(15.9,23.15) 16.12,23.24 arc(16.35,23.34) 16.57,23.24 16.67,23.15 17.24,23.15
HUB_USB1_P: length 8
  Bottom Layer w0.127: USB7.3 13.63,28 14.01,27.62 14.01,26.24 16.58,23.68 17.24,23.68
HUB_USB2_N: length 18.2
  Inner2 w0.127: v1(15.91,22.06) 14.13,20.29 14.13,8.35 v1(13.77,7.98)
  Bottom Layer w0.127: v1(15.91,22.06) 15.93,22.09 17.24,22.09 ; v1(13.77,7.98) 13.75,8 USB6.2
HUB_USB2_P: length 18.2
  Inner2 w0.127: v1(13.72,9.95) 13.72,13.53 arc(13.64,13.71) 13.46,13.79 arc(13.28,13.86) 13.2,14.05 13.2,14.54 arc(13.28,14.73) 13.46,14.8 arc(13.64,14.88) 13.72,15.06 13.72,15.56 arc(13.64,15.74) 13.46,15.82 arc(13.28,15.9) 13.2,16.08 13.2,16.58 arc(13.28,16.76) 13.46,16.84 arc(13.64,16.91) 13.72,17.1 13.72,20.86 v1(15.46,22.6)
  Bottom Layer w0.127: v1(13.72,9.95) 13.67,10 USB6.3 ; v1(15.46,22.6) 15.48,22.62 17.24,22.62
LCD_PWM: length 32.9
  Inner2 w0.127: v1(33.05,11.39) 33.78,12.12 33.78,13.97 35.43,15.62 49.68,15.62 51.18,17.13 51.18,21.34 51.94,22.1 v1(54.81,22.1)
  Bottom Layer w0.127: v1(33.05,11.39) 33.27,11.17 U8.52 ; U3.5 54.48,21.77 v1(54.81,22.1)
LCD_RES: length 28
  Inner2 w0.127: v1(36.35,17.31) 36.35,18.16 v1(36.79,18.6)
  Inner2 w0.152: v1(36.35,14.63) 54.22,14.63 54.43,14.83 v1(54.52,14.83)
  Bottom Layer w0.127: v1(36.79,18.6) 36.61,18.77 U8.33 ; v1(36.35,14.63) v1(36.35,17.31)
  Bottom Layer w0.203: FPC1.18 57.7,13.62 56.63,13.62 55.73,14.51 R44.1 54.8,14.83 v1(54.52,14.83)
LED+: length 13.6
  Inner2 w0.305: v1(51.05,15.24) 53.97,15.24 55.35,16.62 v1(56.26,16.62)
  Bottom Layer w0.305: v1(51.05,15.24) 51.05,20.31 D1.2 ; FPC1.24 v1(56.26,16.62)
LED-: length 7
  Bottom Layer w0.305: FPC1.22 55.13,15.62 55.13,16.06 ; R14.2 55.07,16.13 55.13,16.06 ; 55.13,16.06 U3.1
PC_N: length 44.1
  Inner2 w0.127: v1(15.23,35.38) 15.34,35.49 18.91,35.49 22.69,31.7 22.69,29.51 22.71,29.5 22.69,29.48 22.69,21.39 22.7,21.39 23.36,20.73 36.62,20.73 v1(40.34,24.45)
  Bottom Layer w0.127: USB5.B7 14.25,37.31 14.44,37.5 15.05,37.5 15.26,37.29 15.26,36.43 USB5.A7 15.25,35.4 v1(15.23,35.38) ; U10.19 40.16,24.27 v1(40.34,24.45)
PC_P: length 44.1
  Inner2 w0.127: v1(15.76,34.96) 19.04,34.96 22.41,31.59 22.41,21.26 23.22,20.45 37.18,20.45 v1(40.93,24.21)
  Bottom Layer w0.127: v1(40.93,24.21) 40.56,23.84 U10.20 ; USB5.B6 15.75,34.97 v1(15.76,34.96) 14.45,34.96 arc(14.27,35.03) 14.2,35.21 arc(14.26,35.35) 14.4,35.41 14.45,35.41 arc(14.72,35.56) 14.75,35.87
RESET: length 47
  Top Layer w0.127: v1(63.22,36.72) 62.05,36.72 60.08,34.75 57,34.75 52.98,30.74 52.98,28.46 51.04,26.52 44.61,26.52 43.37,25.27 37.74,25.27 v1(36.55,24.08)
  Inner2 w0.127: v1(36.55,24.08) 35.45,22.99 32.55,22.99 v1(31.31,21.75)
  Bottom Layer w0.127: U8.27 31.5,21.56 v1(31.31,21.75) ; v1(63.22,36.72) 64.03,36.72 SW1.1 65.71,38.41 R49.1 C73.1
SDC0_CLK: length 5.9
  Bottom Layer w0.127: 23.79,25.88 24.31,25.37 U8.9
SDC0_CMD: length 36.7
  Top Layer w0.127: v1(34.28,34.76) 33.15,35.89 33.15,38.35 31.62,39.88 28.76,39.88 v1(27.61,41.03)
  Inner2 w0.127: v1(24.71,21.46) 24.71,38.13 24.87,38.29 arc(25.05,38.37) 25.23,38.29 25.42,38.1 arc(25.78,38.1) 25.78,38.46 25.59,38.65 arc(25.59,39.01) 25.95,39.01 26.14,38.82 arc(26.5,38.82) 26.5,39.18 26.31,39.37 arc(26.23,39.55) 26.31,39.73 v1(27.61,41.03)
  Bottom Layer w0.127: U8.10 v1(24.71,21.46) ; SIM1.3 v1(27.61,41.03) ; 34.99,34.76 v1(34.28,34.76)
SDC0_D0: length 38.7
  Top Layer w0.127: v1(23.21,41.03) 24.87,39.37 31.37,39.37 32.64,38.1 32.64,35.15 v1(34.28,33.51)
  Inner2 w0.127: v1(23.21,41.03) 23.91,40.33 v1(23.91,21.46)
  Bottom Layer w0.127: 34.99,33.51 v1(34.28,33.51) ; U8.8 v1(23.91,21.46) ; v1(23.21,41.03) SIM1.7
SDC0_D1: length 40.9
  Top Layer w0.127: v1(22.11,41.03) 24.28,38.86 31.12,38.86 32.13,37.85 32.13,34.41 v1(34.28,32.26)
  Inner2 w0.127: v1(22.11,41.03) 22.11,41.02 23.5,39.62 v1(23.5,22.22)
  Bottom Layer w0.127: SIM1.8 v1(22.11,41.03) ; U8.7 v1(23.5,22.22) ; 34.99,32.26 v1(34.28,32.26)
SDC0_D2: length 38.4
  Top Layer w0.127: v1(34.29,38.51) 31.81,40.99 v1(29.84,40.99)
  Inner2 w0.127: v1(29.84,40.99) 30.76,40.99 31.12,40.64 31.12,38.48 30.86,38.23 30.47,38.23 arc(30.29,38.3) 30.22,38.48 30.22,38.99 arc(29.96,39.24) 29.71,38.99 29.71,38.48 arc(29.46,38.23) 29.2,38.48 29.2,38.99 arc(28.95,39.24) 28.69,38.99 28.69,38.48 arc(28.44,38.23) 28.19,38.48 28.19,38.99 arc(27.93,39.24) 27.68,38.99 27.68,38.48 arc(27.6,38.3) 27.42,38.23 27.08,38.23 25.5,36.65 v1(25.5,21.46)
  Bottom Layer w0.127: v1(34.29,38.51) R15.1 ; v1(25.5,21.46) U8.12 ; v1(29.84,40.99) 29.84,42 SIM1.1
SDC0_D3: length 36.3
  Top Layer w0.127: v1(34.18,36.46) 33.66,36.99 33.66,38.48 31.75,40.39 29.34,40.39 v1(28.7,41.02)
  Inner2 w0.127: v1(25.1,22.22) 25.1,36.85 27.05,38.8 27.05,39.37 27.3,39.62 30.23,39.62 30.48,39.88 30.48,40.26 30.23,40.51 29.21,40.51 28.7,41.02 v1(28.7,41.02)
  Bottom Layer w0.127: 34.99,36.01 34.61,36.01 34.18,36.44 v1(34.18,36.46) ; SIM1.2 28.7,42.03 v1(28.7,41.02) ; 25.1,20.23 v1(25.1,22.22)
SDC0_DET: length 24.9
  Inner2 w0.127: v1(25.91,22.22) 25.91,35.16 26.68,35.94 v1(31.37,35.94)
  Bottom Layer w0.127: R20.1 33.66,37.26 SIM1.11 32.34,35.94 v1(31.37,35.94) ; U8.13 v1(25.91,22.22)
SPI0_CLK: length 36.9
  Inner2 w0.127: v1(48.64,23.61) 48.75,23.5 48.75,18.91 48.26,18.42 44.96,18.42 43.81,19.56 43.81,23.88 41.91,25.78 29.57,25.78 28.31,24.52 v1(28.31,22.22)
  Bottom Layer w0.127: R27.1 49.53,23.61 v1(48.64,23.61) ; U8.19 v1(28.31,22.22)
SPI0_CS: length 33.3
  Inner2 w0.127: v1(27.91,21.46) 27.91,24.68 29.4,26.18 42.15,26.18 44.2,24.13 44.2,19.81 44.6,19.41 v1(48.3,19.41)
  Bottom Layer w0.127: v1(48.3,19.41) 47.98,19.08 U4.1 47.75,17.56 R22.1 ; U8.18 v1(27.91,21.46)
SPI0_HOLD: length 31.5
  Inner2 w0.127: v1(26.31,21.46) 26.31,25.35 28.74,27.78 44.74,27.78 v1(46.48,26.03)
  Bottom Layer w0.127: R24.1 49.53,25.73 46.79,25.73 v1(46.48,26.03) U4.7 ; U8.14 v1(26.31,21.46)
SPI0_MISO: length 37.8
  Inner2 w0.127: v1(27.1,21.46) 27.1,25.02 29.07,26.98 43.5,26.98 45.59,24.89 46.99,24.89 47.5,24.38 47.5,20.57 47.24,20.31 v1(46.47,20.31)
  Bottom Layer w0.127: U4.2 46.47,19.09 v1(46.47,20.31) 46.59,20.19 49.48,20.19 R25.2 49.66,21.62 ; 27.1,20.23 v1(27.1,21.46)
SPI0_MOSI: length 65.4
  Top Layer w0.127: v1(67.98,38.41) 65.52,38.41 64.31,39.62 61.8,39.62 61.44,39.27 56.13,39.27 55.25,38.38 55.25,33.4 54.48,32.64 53.47,32.64 52.71,31.88 52.71,28.58 50.93,26.8 44.32,26.8 v1(43.56,26.03)
  Inner2 w0.127: v1(27.5,22.22) 27.5,24.85 29.24,26.58 43.01,26.58 v1(43.56,26.03)
  Bottom Layer w0.127: U4.5 43.94,26.42 v1(43.56,26.03) 43.19,25.67 R28.2 R29.1 ; v1(67.98,38.41) 68.81,38.41 R50.1 70.56,38.41 SW2.1 ; U8.17 v1(27.5,22.22)
SPI0_WP: length 38.7
  Inner2 w0.127: v1(26.71,22.22) 26.71,25.18 28.91,27.38 43.87,27.38 45.85,25.4 47.24,25.4 48.01,24.64 48.01,20.32 47.5,19.81 45.37,19.81 v1(45.23,19.96)
  Bottom Layer w0.127: R23.1 44.37,17.42 44.37,17.89 45.21,18.74 U4.3 45.23,19.1 v1(45.23,19.96) ; U8.15 v1(26.71,22.22)
TWI2_SCL: length 32.8
  Top Layer w0.127: v1(39.84,28.36) 38.62,28.36 33.67,23.41 v1(33.67,21.53)
  Inner2 w0.127: v1(39.84,28.36) 54.9,28.36 v1(56.18,29.64)
  Bottom Layer w0.127: v1(33.67,21.53) 33.5,21.36 33.5,21.24 33.5,21.24 U8.32 ; R45.1 53.71,29.64 v1(56.18,29.64) 56.08,29.75 FPC2.4
TWI2_SDA: length 32.5
  Top Layer w0.127: v1(39.31,28.81) 38.67,28.81 33.1,23.24 v1(33.1,21.82)
  Inner2 w0.127: v1(56.38,30.25) 56.19,30.25 54.65,28.71 54.5,28.71 54.4,28.81 v1(39.31,28.81)
  Bottom Layer w0.127: R46.1 53.52,30.25 FPC2.3 v1(56.38,30.25) ; 33.1,20.23 33.1,20.24 v1(33.1,21.82)
UART1_RX: length 18.2
  Inner2 w0.127: v1(37.2,19.6) 36.31,19.6 36.14,19.77 21.92,19.77 21.58,19.43 v1(21.58,19.05)
  Bottom Layer w0.127: v1(21.58,19.05) 21.5,19.12 U8.2 ; U10.8 37.35,19.6 v1(37.2,19.6)
UART1_TX: length 18.3
  Inner2 w0.127: v1(36.66,20.06) 20.72,20.06 v1(20.57,19.91) 20.55,19.89
  Bottom Layer w0.127: U10.9 36.75,20.42 36.66,20.33 36.66,20.06 v1(36.66,20.06) ; 21.1,20.23 20.78,19.91 v1(20.57,19.91)
UART3_RX: length 80.3
  Inner2 w0.127: v1(43.5,30.23) 43.75,30.48 56.01,30.48 56.39,30.86 57.78,30.86 58.17,30.48 58.17,29.08 57.87,28.79 57.87,15.41 61.47,11.81 61.47,7.62 60.2,6.35 57.44,6.35 56.56,7.24 52.32,7.24 50.55,5.46 41.7,5.46 40.43,6.73 36.19,6.73 34.93,5.46 28.16,5.46 27.91,5.72 v1(27.91,6.9)
  Bottom Layer w0.127: U6.8 v1(43.5,30.23) ; U8.79 v1(27.91,6.9)
UART3_TX: length 81.5
  Inner2 w0.127: v1(43,30.86) 55.91,30.86 56.25,31.2 57.93,31.2 58.5,30.62 58.5,28.94 58.21,28.65 58.21,15.55 61.81,11.95 61.81,7.48 60.34,6.01 57.3,6.01 56.41,6.9 52.46,6.9 50.69,5.12 41.56,5.12 40.29,6.39 36.34,6.39 35.07,5.12 27.9,5.12 27.5,5.52 v1(27.5,6.14)
  Bottom Layer w0.127: U6.9 v1(43,30.86) ; U8.80 v1(27.5,6.14)
USB0_N: length 66.3
  Top Layer w0.127: v1(49.34,32.89) 49.63,32.89 49.83,32.69 50.75,32.69 51.71,31.72 51.71,28.84 50.56,27.69 39,27.69 35.97,24.65 35.97,18.05 34.81,16.89 25.79,16.89 24.54,15.63 24.54,13.98 23.79,13.23 21.96,13.23 21.67,12.95 v1(21.38,12.95)
  Inner2 w0.127: v1(56.45,38.45) 56.45,37.62 56.66,37.42 56.66,35.94 53.61,32.89 v1(49.34,32.89)
  Bottom Layer w0.127: v1(21.38,12.95) 21.16,13.17 U8.114 ; USB2.A7 56.45,36.43 v1(56.45,38.45) 55.63,38.45 55.43,38.26 55.43,36.42 USB2.B7 ; D3.3 v1(49.34,32.89)
USB0_P: length 66.4
  Top Layer w0.127: v1(56.94,37.94) v1(55.94,37.94) ; v1(49.34,32.21) 49.63,32.21 49.83,32.41 50.63,32.41 51.44,31.61 51.44,28.96 50.44,27.97 38.89,27.97 35.69,24.77 35.69,18.16 34.7,17.17 25.68,17.17 24.26,15.75 24.26,14.1 23.67,13.51 21.96,13.51 21.67,13.8 v1(21.38,13.8)
  Inner2 w0.127: v1(49.34,32.21) 53.32,32.21 53.56,32.45 arc(53.86,32.57) 54.16,32.45 arc(54.46,32.32) 54.76,32.45 54.88,32.57 arc(55,32.87) 54.88,33.17 arc(54.75,33.47) 54.88,33.77 55,33.89 arc(55.3,34.01) 55.6,33.89 arc(55.89,33.76) 56.19,33.89 56.31,34.01 arc(56.44,34.3) 56.31,34.6 arc(56.19,34.9) 56.31,35.2 56.94,35.83 v1(56.94,37.94)
  Bottom Layer w0.127: D3.2 v1(49.34,32.21) ; USB2.A6 v1(55.94,37.94) ; U8.115 21.16,13.57 v1(21.38,13.8) ; USB2.B6 v1(56.94,37.94)
USB1_5V: length 22
  Bottom Layer w0.254: USB5.A4 USB5.B9 12.75,37.19 12.92,37.36 12.92,39.4 12.93,39.41 ; USB5.A9 USB5.B4 17.25,37.19 17.05,37.39 17.05,39.36 17.01,39.41
  Bottom Layer w0.762: 12.09,39.41 20.1,39.41 21.44,38.07 21.44,35.88 19.65,34.09 F2.1
USB1_N: length 16.6
  Inner2 w0.127: v1(18.58,24.09) 19.53,23.13 19.53,21.69 arc(19.44,21.48) 19.23,21.39 arc(19.02,21.3) 18.93,21.09 18.93,20.68 arc(19.02,20.46) 19.23,20.37 arc(19.44,20.28) 19.53,20.07 19.53,19.66 arc(19.44,19.45) 19.23,19.36 arc(19.02,19.27) 18.93,19.05 18.93,18.64 arc(19.02,18.43) 19.23,18.34 arc(19.44,18.25) 19.53,18.04 19.53,13.48 19.18,13.12 v1(18.3,13.12)
  Bottom Layer w0.127: v1(18.58,24.09) 18.46,24.21 17.24,24.21 ; U8.113 19.64,12.78 18.67,12.78 18.32,13.12 v1(18.3,13.12)
USB1_P: length 16.7
  Inner2 w0.127: v1(18.59,24.74) 19.84,23.5 19.84,13.08 19.29,12.53 18.36,12.53 v1(18.31,12.49)
  Bottom Layer w0.127: v1(18.59,24.74) 18.58,24.74 17.24,24.74 ; U8.112 18.43,12.37 v1(18.31,12.49)
USB2_5V: length 38
  Top Layer w1.524: 15.47,5.18 12.81,5.18 v1(12.56,5.43) 12.56,33.45
  Bottom Layer w1.016: USB6.1 v1(14.43,5.5) 15.1,5.5 C87.2 ; C88.2 13.03,22.34 USB7.1
  vias: v1(12.21,23.52) v1(12.35,33.66) v1(12.36,32.95) v1(12.92,23.51) v1(12.96,33.67) v1(12.98,32.95) v1(13.62,5.51)
USB_5V: length 45.3
  Bottom Layer w0.127: USB2.A9 USB2.B4
  Bottom Layer w0.254: 40.84,39.1 40.84,37.36 40.67,37.19 USB1.B9 USB1.A4 ; 54.1,39.1 54.1,37.41 54.12,37.39 53.94,37.21 USB2.B9 USB2.A4 ; USB1.A9 USB1.B4 45.17,37.19 45,37.36 45,39.01 ; USB2.B4 58.44,37.18 58.2,37.42 58.21,37.42 58.21,39.1
  Bottom Layer w0.508: D3.4 51.2,33.79 51.2,34.54 50.91,34.83 48.9,34.83 ; 48.9,34.83 48.9,39.07 ; 48.9,34.83 D2.4
  Bottom Layer w0.762: 59.18,39.2 59.17,39.21 53.23,39.21 53.09,39.07 48.9,39.07 48.78,39.19 38.52,39.19 36.74,40.98 F1.1
$1N3179: length 2.3
  Bottom Layer w0.254: U1.21 48,3.08 R9.2
$1N3183: length 2.3
  Bottom Layer w0.254: R8.2 47.5,3.09 U1.22
$1N3187: length 2.3
  Bottom Layer w0.254: R7.2 47.5,10.49 U1.9
$1N3191: length 2.3
  Bottom Layer w0.254: U1.10 48,10.5 R6.2
$1N3433: length 6.4
  Bottom Layer w0.254: U1.14 52.35,7.55 R2.2 53.37,7.5 C3.1 54.27,7.61 R1.1
$1N3555: length 6.4
  Bottom Layer w0.254: U1.17 52.33,6.05 R12.1 53.37,6.08 C13.1 54.27,5.97 R11.2
$1N3564: length 6.2
  Bottom Layer w0.254: 41.23,5.5 C10.1 ; 41.23,5.5 41.23,4.43 ; 41.23,5.5 42.48,5.5 R10.1 43.41,6.05 U1.2
$1N3584: length 6.2
  Bottom Layer w0.254: 41.23,9.15 41.23,8.08 C6.1 42.37,7.97 R4.1 43.39,7.55 U1.5
$2N2442: length 6.3
  Bottom Layer w0.127: 49.66,24.61 48.99,25.27 45.72,25.27 45.21,25.78 U4.6
$2N12486: length 16
  Inner2 w0.152: v1(25.26,40.64) 24.31,39.69 v1(24.31,28.06)
  Bottom Layer w0.152: R21.1 23.81,26.76 23.81,27.65 24.23,28.06 v1(24.31,28.06) ; SIM1.5 25.41,40.79 v1(25.26,40.64)
$4N700: length 1.9
  Bottom Layer w0.254: U5.9 21.3,25.8 C33.1
$4N704: length 1.5
  Bottom Layer w0.254: C34.1 22.33,25.27 U5.10
$4N1305: length 3.7
  Bottom Layer w0.203: U5.11 20.15,24.74 19.96,24.92 19.96,26.09 20.68,26.81 X1.3
$4N1318: length 6.5
  Bottom Layer w0.203: X1.1 19.48,28.9 19.74,28.65 19.74,26.37 19.6,26.23 19.6,24.73 20.12,24.21 20.83,24.21 U5.12
$4N1950: length 5.4
  Bottom Layer w0.203: 17.24,25.27 16.48,25.27 16.24,25.51 16.24,26.07 C31.1 16.91,29.39 L6.2
$4N8389: length 1.7
  Bottom Layer w0.203: C84.2 39.76,18.13 39.76,19.22
$6N461: length 4.6
  Bottom Layer w0.203: L7.2 53.51,27.75 C55.2 53.59,28.45 53.89,28.75 FPC2.6
$6N16088: length 9.8
  Top Layer w0.127: v1(57.75,35.27) 57.75,37.91 58.55,38.71 61.95,38.71 v1(62.23,38.99)
  Bottom Layer w0.127: v1(57.75,35.27) 57.94,35.46 USB2.B5 ; R55.2 v1(62.23,38.99)
$6N16096: length 10.8
  Top Layer w0.127: v1(54.71,35.15) 54.68,35.18 54.68,39.33 54.11,39.89 v1(50.22,39.89)
  Bottom Layer w0.127: USB2.A5 54.94,35.38 v1(54.71,35.15)
  Bottom Layer w0.203: R56.2 50.21,39.9 v1(50.22,39.89)
$6N16224: length 6.8
  Bottom Layer w0.127: R58.2 38.74,32.39 39.37,33.02 41.15,33.02 41.67,33.54 41.67,36.4
$6N16228: length 10.9
  Top Layer w0.127: v1(44.87,34.66) 44.96,34.75 44.96,38.31 45.72,39.07 48.39,39.07 49,39.68 v1(49,39.92)
  Bottom Layer w0.127: 44.67,36.4 44.67,34.87 v1(44.87,34.66)
  Bottom Layer w0.203: v1(49,39.92) 49,40.42 R57.2
$6N17360: length 15.9
  Inner2 w0.203: v1(16.53,34.51) 15.2,34.51 13.34,36.37 13.34,38.25 12.53,39.05 v1(6.4,39.05)
  Bottom Layer w0.203: v1(6.4,39.05) 6.53,38.92 R59.2
  Bottom Layer w0.254: v1(16.53,34.51) 16.75,34.73 USB5.B5
$6N17361: length 8.1
  Inner2 w0.203: v1(9.12,39.51) 12.89,39.51 13.76,38.63 v1(13.76,37.71)
  Bottom Layer w0.203: v1(9.12,39.51) 9.03,39.51 R60.2
  Bottom Layer w0.254: USB5.A5 13.75,37.69 v1(13.76,37.71)
$7N2651: length 9.9
  Bottom Layer w0.127: C62.1 26.58,27.5 X3.1 27.43,26.49 27.43,24.77 29.5,22.69 U8.22
$7N2652: length 9.8
  Bottom Layer w0.127: C63.2 27.56,28.41 27.56,26.76 X3.3 28.4,24.43 29.91,22.93 U8.23
$7N2654: length 7.8
  Bottom Layer w0.127: C65.1 30.48,26.54 X4.1 29.93,23.53 30.31,23.16 U8.24
$7N2686: length 9.2
  Bottom Layer w0.127: U8.30 32.71,22.42 34.93,24.64 37.23,24.64 C66.2
$7N2695: length 2.9
  Bottom Layer w0.203: R47.2 36.88,13.17 U8.47
$7N2745: length 2.8
  Bottom Layer w0.203: U8.78 28.31,3.26 R48.1
$7N2813: length 8.4
  Bottom Layer w0.127: U8.25 30.71,23.85 32.43,25.58 X4.2 31.88,26.55 C70.1
$7N2862: length 3.2
  Bottom Layer w0.203: C61.2 16.72,9.97 U8.106
$7N2876: length 2.5
  Bottom Layer w0.203: L8.2 23.91,3.51 U8.89
$7N4200: length 8.4
  Bottom Layer w0.203: D4.2 36.48,25.77 C60.1 34.81,25.16 32.31,22.65 U8.29
$7N4281: length 2.8
  Bottom Layer w0.203: U8.92 22.71,3.58 C69.2
$7N4286: length 2.5
  Bottom Layer w0.203: U8.90 23.5,2.96 C71.2
$7N4343: length 6.5
  Bottom Layer w0.203: C67.1 18.66,2.55 18.03,3.17 18.03,5.84 18.56,6.37 U8.97
$7N4463: length 3.4
  Bottom Layer w0.203: U8.110 17.17,11.57 C58.2
$7N4468: length 3.7
  Bottom Layer w0.203: C57.2 17.96,11.97 U8.111
$7N7429: length 6.2
  Bottom Layer w0.203: C59.1 33.6,24.58 31.91,22.89 U8.28

## Copper pours and planes (outline as drawn; the poured copper is in the pictures)
0.9V on Bottom Layer: 53.96,1.52 53.96,2.5 56.25,2.5 56.25,6.34 54.7,6.34 54.7,3.68 52.57,3.68 52.57,1.51 53.96,1.51
1.5V on Bottom Layer: 42.93,1.53 42.92,1.52 41.53,1.52 41.53,2.5 39.28,2.5 39.24,2.54 39.24,5.97 40.79,5.97 40.79,3.81 42.93,3.81
1.8V on Bottom Layer: 41.53,12.06 41.53,11.08 39.24,11.08 39.24,7.62 40.79,7.62 40.79,9.9 42.93,9.9 42.93,12.07 41.54,12.07
3.3V on Top Layer: 50.27,25.63 51.07,25.63 51.07,24.05 50.27,24.05
3.3V on Bottom Layer: 52.57,12.05 52.58,12.06 53.96,12.06 53.96,11.08 56.21,11.08 56.25,11.04 56.25,7.23 54.7,7.23 54.7,9.77 52.57,9.77
5V on Bottom Layer: 55.63,25.42 55.63,23.01 56.88,23.01 56.88,21.58 54.91,21.58 54.91,20.75 55.75,20.75 55.75,19.94 58.19,19.94 58.19,25.42
5V on Bottom Layer: 15.84,34.03 19.86,34.03 19.86,30.5 15.84,30.5
GND on Top Layer: -3.76,45.74 78.25,45.74 78.25,-2.7 -3.76,-2.7
GND on Bottom Layer: -4.74,46.58 79.09,46.58 79.09,-3.4 -4.74,-3.4
GND on Inner1: -1.66,44.48 76.36,44.48 76.36,-1.23 -1.66,-1.23
GND on Inner2: -2.64,44.9 77.48,44.9 77.48,-1.86 -2.64,-1.86
USB2_5V on Bottom Layer: 11.95,34.05 14.97,34.05 14.97,32.53 11.95,32.53
$1N988 on Bottom Layer: 48.76,8.38 48.76,9.52 50.4,9.52 50.4,12.05 50.41,12.06 51.81,12.06 51.81,8.37 48.76,8.37
$1N1593 on Bottom Layer: 46.74,8.38 43.69,8.38 43.69,12.06 44.96,12.06 44.96,9.53 46.74,9.53
$1N1596 on Bottom Layer: 46.74,5.21 46.74,4.06 45.09,4.06 45.09,1.53 45.09,1.52 43.69,1.52 43.69,5.21 46.73,5.21
$1N1602 on Bottom Layer: 48.76,5.2 51.81,5.2 51.81,1.52 50.54,1.52 50.54,4.06 48.76,4.06
$1N4672 on Bottom Layer: 51.18,25.4 51.18,23.11 53.24,23.11 53.24,20.73 53.21,20.7 53.97,20.7 53.97,25.4

Small or netless copper shapes (teardrops, artwork), in the pictures only: 46 on Top Layer, 507 on Bottom Layer, 2 on Inner1, 92 on Inner2

## Text on the board
Bottom Silkscreen Layer: BOOT | RST | FEL
Top Silkscreen Layer: 正式版 2.0
